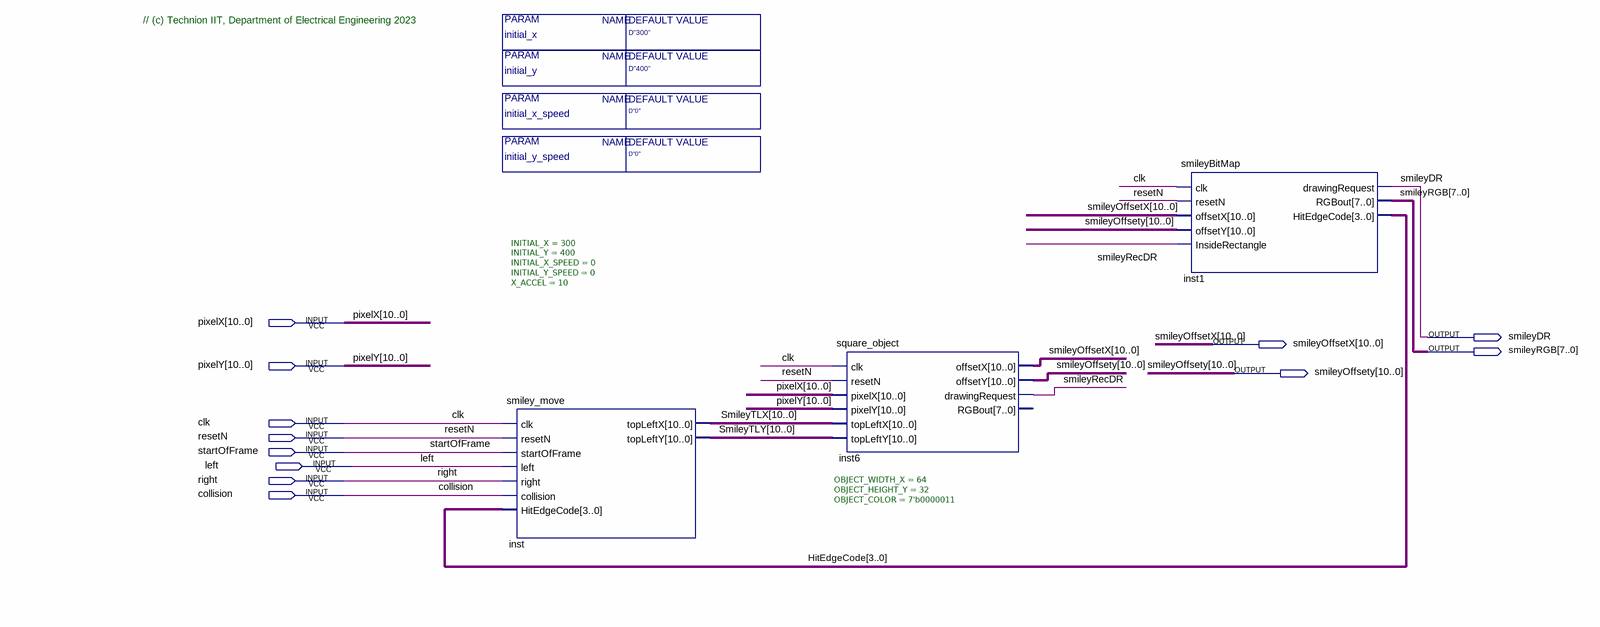
[diagram p0: schematic sheet]
// Quartus schematic Smiley_Block_T.bdf as structural Verilog: 3 symbols, 12 pins
module Smiley_Block_T #(parameter initial_y = "D\"400\"", parameter initial_x_speed = "D\"0\"", parameter initial_y_speed = "D\"0\"", parameter initial_x = "D\"300\"") (
  input  [10:0] pixelX,
  input  [10:0] pixelY,
  input  clk,
  input  resetN,
  input  startOfFrame,
  input  left,
  input  right,
  input  collision,
  output smileyDR,
  output [10:0] smileyOffsetX,
  output [7:0] smileyRGB,
  output [10:0] smileyOffsety
);

  wire smileyRecDR;
  wire [3:0] HitEdgeCode;
  wire [10:0] SmileyTLX, SmileyTLY;

  smiley_move #(.INITIAL_X(300), .INITIAL_Y(400), .INITIAL_X_SPEED(0), .INITIAL_Y_SPEED(0), .X_ACCEL(10)) inst (
    .clk(clk), .resetN(resetN), .startOfFrame(startOfFrame), .left(left), .right(right),
    .collision(collision), .HitEdgeCode(HitEdgeCode), .topLeftX(SmileyTLX), .topLeftY(SmileyTLY));
  square_object #(.OBJECT_WIDTH_X(64), .OBJECT_HEIGHT_Y(32), .OBJECT_COLOR(7'b0000011)) inst6 (
    .clk(clk), .resetN(resetN), .pixelX(pixelX), .pixelY(pixelY), .topLeftX(SmileyTLX), .topLeftY(SmileyTLY),
    .offsetX(smileyOffsetX), .offsetY(smileyOffsety), .drawingRequest(smileyRecDR));  // open: RGBout
  smileyBitMap inst1 (
    .clk(clk), .resetN(resetN), .offsetX(smileyOffsetX), .offsetY(smileyOffsety),
    .InsideRectangle(smileyRecDR), .drawingRequest(smileyDR), .RGBout(smileyRGB), .HitEdgeCode(HitEdgeCode));

  // Notes on the sheet:
  //   // (c) Technion IIT, Department of Electrical Engineering 2023
endmodule
